# Altium schematic sheet 5V_Isolated_Power_Supply.SchDoc: RP2040 CNC
size B; Author: AM; CompanyName: Expatria Technologies; DrawnBy: A.Marles; Engineer: AM; Organization: Expatria Technolgoies; DocumentNumber: 9; SheetNumber: 9; SheetTotal: 13
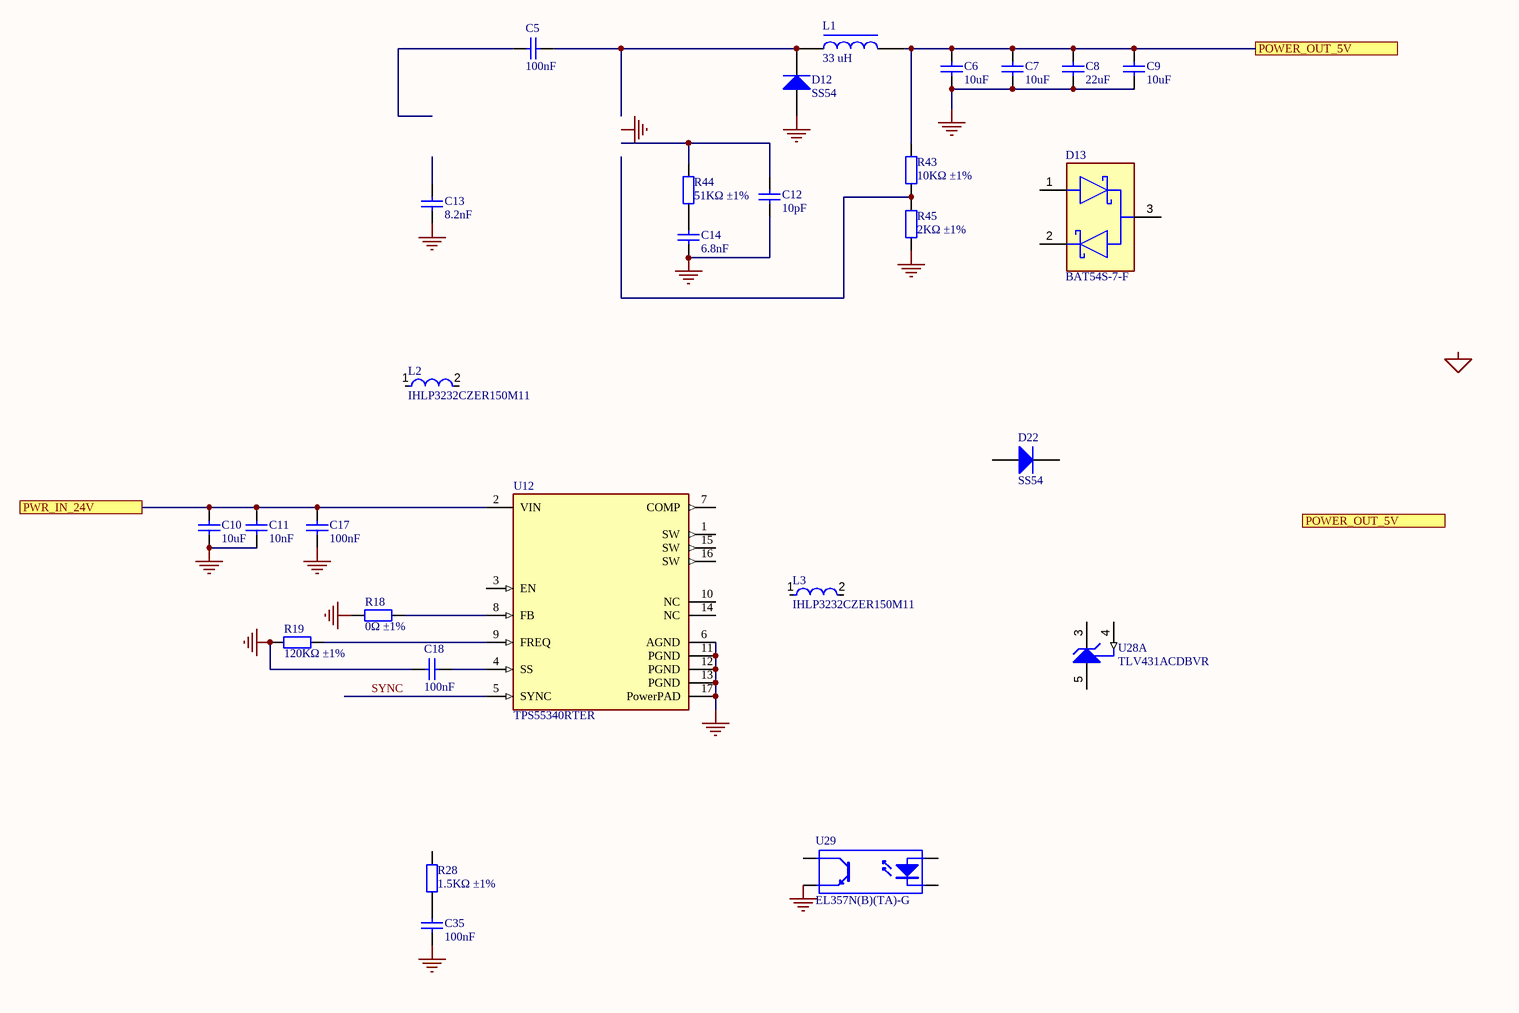
[diagram p0: 5V_Isolated_Power_Supply.SchDoc]

## Parts
C5  100nF  [0603_C]
C6  10uF  [0603_C]
C7  10uF  [0603_C]
C8  22uF  [0805_C]
C9  10uF  [0603_C]
C10  10uF  [1206_C]
C11  10nF  [0402_C]
C12  10pF  [0402_C]
C13  8.2nF  [0603_C]
C14  6.8nF  [0402_C]
C17  100nF  [0603_C]
C18  100nF  [0603_C]
C35  100nF  [0603_C]
D12  SS54  [SMA(DO-214AC)_S1]
D13  BAT54S-7-F  [FP-SOT23-MFG]
D22  SS54  [SMA(DO-214AC)_S1]
L1  33 uH  [INDPM7366X300N]
L2  IHLP3232CZER150M11  [FP-IHLP-3232CZ-FP_2_413x5-MFG]
L3  IHLP3232CZER150M11  [FP-IHLP-3232CZ-FP_2_413x5-MFG]
R18  0Ω ±1%  [0402_R]
R19  120KΩ ±1%  [0402_R]
R28  1.5KΩ ±1%  [0402_R]
R43  10KΩ ±1%  [0402_R]
R44  51KΩ ±1%  [0402_R]
R45  2KΩ ±1%  [0402_R]
U12  TPS55340RTER  [FP-RTE0016C-IPC_A]
U28  TLV431ACDBVR  [DBV0005A_L]  (part A of 2)
U29  EL357N(B)(TA)-G  [SOP-4_P2.54]

## Ports
POWER_OUT_5V, PWR_IN_24V

## Nets
GND: C6.1 C7.1 C8.1 C9.1 C10.1 C11.1 C12.1 C13.1 C14.1 C17.1 C18.2 C35.1 D12.1(A) R18.1 R19.1 R45.1 U12.6(AGND) U12.11(PGND) U12.12(PGND) U12.13(PGND) U12.17(PowerPAD) U29.3(E)
POWER_OUT_5V: C6.2 C7.2 C8.2 C9.2 L1.2 R43.2 ; port POWER_OUT_5V
PWR_IN_24V: C10.2 C11.2 C17.2 U12.2(VIN) ; port PWR_IN_24V
SYNC: U12.5(SYNC)
NetC5_2: C5.2 D12.2(K) L1.1
NetC12_2: C12.2 R44.2
NetC14_2: C14.2 R44.1
NetC18_1: C18.1 U12.4(SS)
NetC35_2: C35.2 R28.1
NetR18_2: R18.2 U12.8(FB)
NetR19_2: R19.2 U12.9(FREQ)
NetR43_1: R43.1 R45.2

Not connected (* = marked no-connect by the designer): C5 1; C13 2; D13 1 2 3; D22 1(A) 2(K); L2 1 2; L3 1 2; R28 2; U12 1(SW) 3(EN) 7(COMP) 10(NC) 14(NC) 15(SW) 16(SW); U28 3(CATHODE) 4(REF) 5(ANODE); U29 1(A) 2(K) 4(C)

## Notes on the sheet
- Labels drawn without touching a wire or pin: GND, MCU_GND
- SHEET
- Expatria Technologies
- 1136 Glade Court
- Port Coquitlam, BC V3B 1R5
- PROJECT
- SIZE
- ENGR
- MODIFIED
- DOCUMENT
- REV
- Copyright Expatria Technologies 2021.  This document describes Open Hardware and is licensed under the CERN-OHL-P  v2.  No warranty is implied or expressed.
- EMAIL: INFO@EXPATRIA.CA
- B
- /

## Library data of the parts
C5 C17 C18 C35 = 0603 100nF (104) 10% 50V: Chip capacitors; Manufacturer: YAGEO; PartNumber: CC0603KRX7R9BB104; Tolerance: 10%; Voltage: 50V; ComponentLink1Description: Supplier link; ComponentLink1URL: http://www.szlcsc.com/product/details_15331.html; Package: 0603; Supplier: LC; SuppliersPartNumber: C14663; Capacitance: 100nF
C6 C7 C9 = 0603 10uF (106) 10% 10V: Chip capacitors; Manufacturer: Samsung Electro-Mechanics; PartNumber: CL10A106KP8NNNC; Tolerance: 10%; Voltage: 10V; ComponentLink1Description: Supplier link; ComponentLink1URL: http://www.szlcsc.com/product/details_20411.html; Package: 0603; Supplier: LC; SuppliersPartNumber: C19702; Capacitance: 10uF
C8 = 0805 22uF (226) 20% 25V: Chip capacitors; Manufacturer: Samsung Electro-Mechanics; PartNumber: CL21A226MAQNNNE; Tolerance: 20%; Voltage: 25V; ComponentLink1Description: Supplier link; ComponentLink1URL: http://www.szlcsc.com/product/details_46786.html; Package: 0805; Supplier: LC; SuppliersPartNumber: C45783; Capacitance: 22uF
C10 = 1206 10uF (106) 10% 50V: Chip capacitors; Manufacturer: Samsung Electro-Mechanics; PartNumber: CL31A106KBHNNNE; Tolerance: 10%; Voltage: 50V; ComponentLink1Description: Supplier link; ComponentLink1URL: http://www.szlcsc.com/product/details_14236.html; Package: 1206; Supplier: LC; SuppliersPartNumber: C13585; Capacitance: 10uF
C11 = 0402 10nF (103) 10% 50V: Chip capacitors; Manufacturer: Samsung Electro-Mechanics; PartNumber: CL05B103KB5NNNC; Tolerance: 10%; Voltage: 50V; ComponentLink1Description: Supplier link; ComponentLink1URL: http://www.szlcsc.com/product/details_15869.html; Package: 0402; Supplier: LC; SuppliersPartNumber: C15195; Capacitance: 10nF
C12 = 0402 10pF (100) 5% 50V: Chip capacitors; Manufacturer: Samsung Electro-Mechanics; PartNumber: CL05C100JB5NNNC; Tolerance: 5%; Voltage: 50V; ComponentLink1Description: Supplier link; ComponentLink1URL: http://www.szlcsc.com/product/details_33914.html; Package: 0402; Supplier: LC; SuppliersPartNumber: C32949; Capacitance: 10pF
C13 = 0603 8.2nF (822) 10% 50V: Chip capacitors; Manufacturer: Samsung Electro-Mechanics; PartNumber: CL10B822KB8NNNC; Tolerance: 10%; Voltage: 50V; ComponentLink1Description: Supplier link; ComponentLink1URL: http://www.szlcsc.com/product/details_28670.html; Package: 0603; Supplier: LC; SuppliersPartNumber: C27920; Capacitance: 8.2nF
C14 = 0402 6.8nF (682) 10% 50V: Chip capacitors; Manufacturer: Guangdong Fenghua Advanced Tech; PartNumber: 0402B682K500NT; Tolerance: 10%; Voltage: 50V; ComponentLink1Description: Supplier link; ComponentLink1URL: http://www.szlcsc.com/product/details_1894.html; Package: 0402; Supplier: LC; SuppliersPartNumber: C1542; Capacitance: 6.8nF
D12 = SMA(DO-214AC) SS54: 二极管; ComponentLink1Description: 供应商链接; ComponentLink1URL: http://www.szlcsc.com/product/details_23178.html; Package: SMA(DO-214AC); Supplier: LC; SuppliersPartNumber: C22452
D13 = CMP-1667-00006-2: DIODE ARRAY SCHOTTKY 30V SOT23-3; SuppliersPartNumber: C408389
D22 = SMA(DO-214AC) SS54: 40V 5A 550mV @ 5A SMA(DO-214AC) Schottky Barrier Diodes (SBD) ROHS; ComponentLink1Description: 供应商链接; ComponentLink1URL: http://www.szlcsc.com/product/details_23178.html; Package: SMA(DO-214AC); Supplier: LC; SuppliersPartNumber: C22452
L1 = 1206 10uH 10%: 33uH ±20% 2A 270mΩ SMD,6.6x7.3x3.0mm Power Inductors RoHS; ComponentLink1Description: 供应商链接; ComponentLink1URL: http://www.szlcsc.com/product/details_1403.html; Package: SMD_6.6x7.3x3.0mm; Supplier: JLCPCB; SuppliersPartNumber: C329385
L2 L3 = CMP-02424-000494-1: Commercial Inductors, Low DCR Series 15uH 4.3A 85.3mΩ 20%; Test Frequency: 100kHz; Core Material: Ferrite; DC Resistance (DCR): 85.3mR; Shielding: Shielded; Saturation Current: 3.8A; Self Resonant Frequency: 11MHz; Package Quantity: 1000; Packaging: Tape and Reel; Case/Package: 3232; Radiation Hardening: No; Number of Pins: 2; Mount: Surface Mount; Length: 0.34inch; Military Standard: Not; Max Operating Temperature: 125°C; Termination: SMD/SMT; Tolerance: 20%; Inductance: 15uH; Height - Seated (Max): 0.118inch; RMS Current (Irms): 4.3A; Height: 3mm; Lead Free: Lead Free; Width: 0.322inch; Current Rating: 4.3A; Min Operating Temperature: -55°C; Inductance Tolerance: 20%; Depth: 8.26mm; Max DC Current: 3.8A
R18 = 0402 0R (0R0) 1%: Chip resistor; Manufacturer: Uniroyal Elec; PartNumber: 0402WGF0000TCE; Power: 1/16W; ComponentLink1Description: Supplier link; ComponentLink1URL: http://www.szlcsc.com/product/details_17853.html; Package: 0402; Supplier: LC; SuppliersPartNumber: C17168; Resistance: 0Ω; Tolerance: 1%
R19 = 0402 120K (1203) 1%: Chip resistor; Manufacturer: Uniroyal Elec; PartNumber: 0402WGF1203TCE; Power: 1/16W; ComponentLink1Description: Supplier link; ComponentLink1URL: http://www.szlcsc.com/product/details_26493.html; Package: 0402; Supplier: LC; SuppliersPartNumber: C25750; Resistance: 120KΩ; Tolerance: 1%
R28 = 0402 1.5K (1501) 1%: Chip resistor; Manufacturer: Uniroyal Elec; PartNumber: 0402WGF1501TCE; Power: 1/16W; ComponentLink1Description: Supplier link; ComponentLink1URL: http://www.szlcsc.com/product/details_26610.html; Package: 0402; Supplier: LC; SuppliersPartNumber: C25867; Resistance: 1.5KΩ; Tolerance: 1%
R43 = 0402 10K (1002) 1%: Chip resistor; Manufacturer: Uniroyal Elec; PartNumber: 0402WGF1002TCE; Power: 1/16W; ComponentLink1Description: Supplier link; ComponentLink1URL: http://www.szlcsc.com/product/details_26487.html; Package: 0402; Supplier: LC; SuppliersPartNumber: C25744; Resistance: 10KΩ; Tolerance: 1%
R44 = 0402 51K (5102) 1%: Chip resistor; Manufacturer: Uniroyal Elec; PartNumber: 0402WGF5102TCE; Power: 1/16W; ComponentLink1Description: Supplier link; ComponentLink1URL: http://www.szlcsc.com/product/details_26537.html; Package: 0402; Supplier: LC; SuppliersPartNumber: C25794; Resistance: 51KΩ; Tolerance: 1%
R45 = 0402 2K (2001) 1%: Chip resistor; Manufacturer: Uniroyal Elec; PartNumber: 0402WGF2001TCE; Power: 1/16W; ComponentLink1Description: Supplier link; ComponentLink1URL: http://www.szlcsc.com/product/details_4516.html; Package: 0402; Supplier: LC; SuppliersPartNumber: C4109; Resistance: 2KΩ; Tolerance: 1%
U12 = CMP-04918-000344-1: IC REG BOOST ADJ 5.25A 16WQFN; Number of Outputs: 1; Max Output Current: 5A; Max Output Voltage: 38V; Quiescent Current: 500uA; Synchronous Rectifier: No; Output Type: Adjustable; Switching Frequency: 1.14MHz; Min Input Voltage: 2.9V; Max Input Voltage: 32V; Topology: Boost; Number of Pins: 16; RoHS Compliant: Yes; Package Quantity: 3000; REACH SVHC: No SVHC; Mount: Surface Mount; Max Operating Temperature: 150°C; Contact Plating: Gold; Output Voltage: 38V; Min Operating Temperature: -40°C; Output Current: 5A; Lead Free: Lead Free; Series: -; Min Output Voltage: 2.9V; Packaging: Tape and Reel; SuppliersPartNumber: C169167
U28 = CMP-0366-00772-2: Low Voltage Adjustable Precision Shunt Regulator, 39 ppm / degC, 15 mA, 0 to 70 degC, 5-pin SOT-23 (DBV), Green (RoHS & no Sb/Br); Manufacturer: Texas Instruments; Min Iz for Regulation(uA): 80; VO Adj(Max)(V): 6; VO Adj(Min)(V): 1.24; SubFamily: Shunt Voltage Reference; Temp Coeff(Max)(ppm/ degree C): 129; Rating: Catalog; Temp Coeff(Typ)(ppm/ degree C): 39; Iout/Iz(Max)(mA): 15; ComponentLink1URL: http://www.ti.com/; ComponentLink1Description: Manufacturer URL; DatasheetVersion: SLVS139T; ComponentLink2URL: http://www.ti.com/general/docs/lit/getliterature.tsp?genericPartNumber=TLV431A&fileType=pdf; PackageReference: DBV0005A; Mounting Technology: Surface Mount; PartNumber: TLV431ACDBVR; ComponentLink3Description: Package Specification; Eco-Plan: Green (RoHS & no Sb/Br); ComponentLink2Description: Datasheet; Code_JEDEC: MO-178; PackageDescription: 5-Pin Plastic Small Outline, Body 1.60 Ã— 2.90 mm, Pitch 0.95 mm; PackageVersion: 4073253-4/K; ComponentLink3URL: http://www.ti.com/litv/pdf/mpds018i; SuppliersPartNumber: C60268
U29 = EL357N(B)(TA)-G_[C6649]: 贴片光耦; ComponentLink1Description: 供应商链接; ComponentLink1URL: http://www.szlcsc.com/product/details_7114.html; Package: SOP-4_P2.54; Supplier: LC; SuppliersPartNumber: C6649